# Altium schematic sheet Steering_Wheel_ECU.SchDoc
size A4
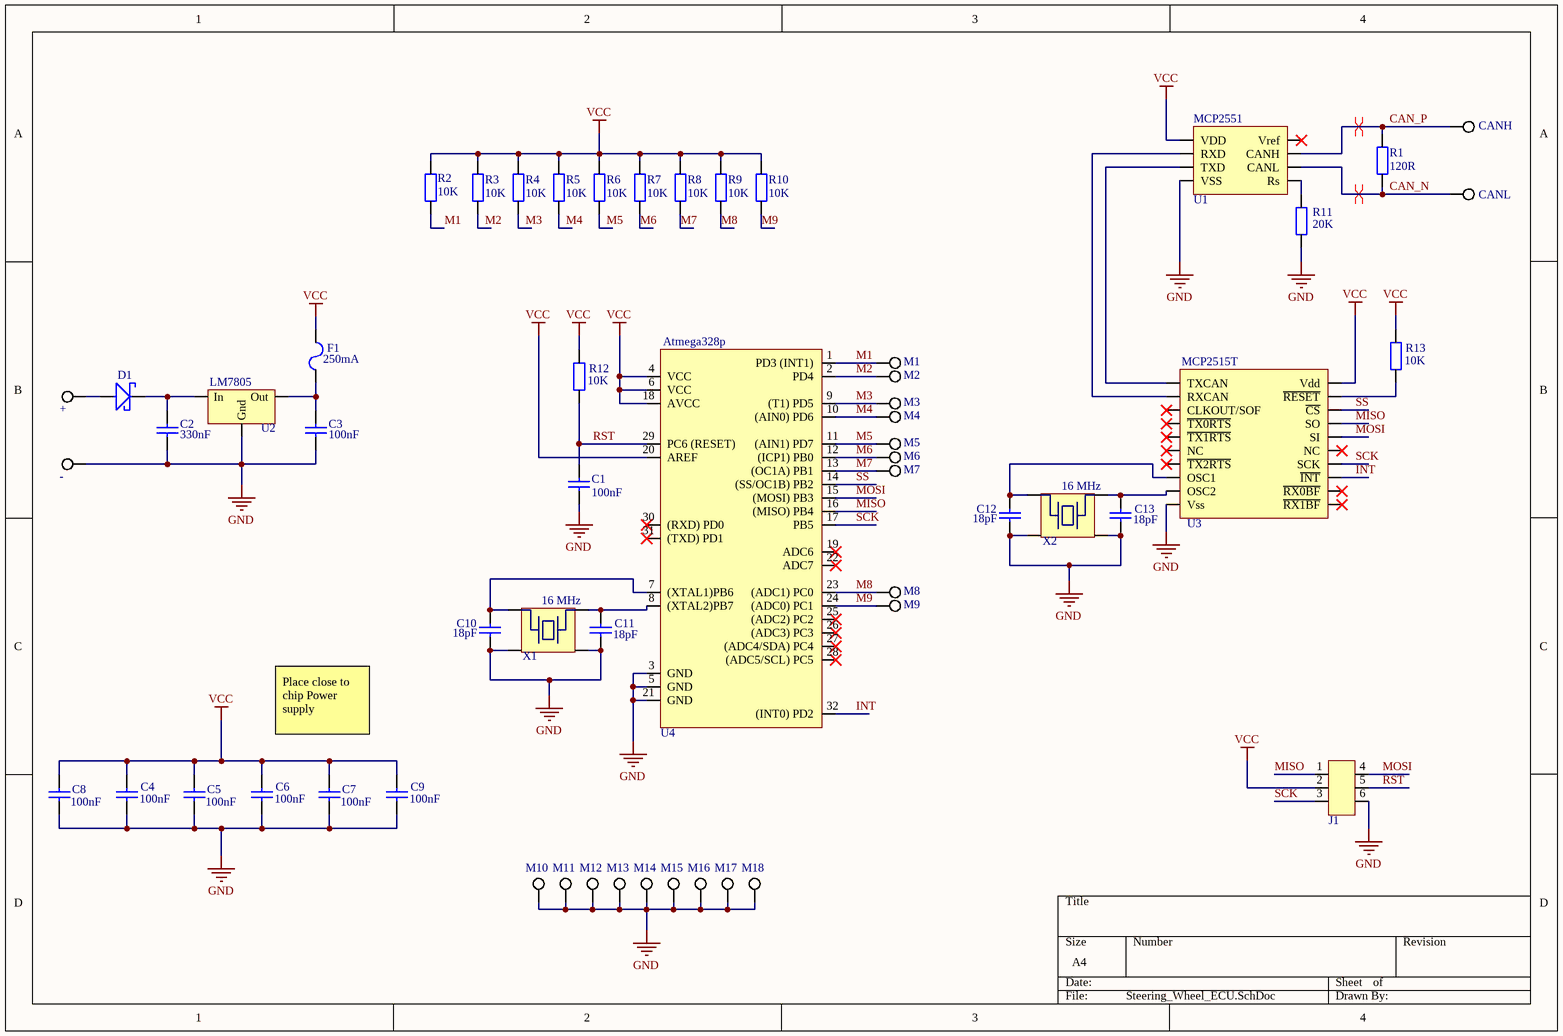
[diagram p0: Steering_Wheel_ECU.SchDoc]

## Parts
+  0.7mm  [HOLE_0.7MM]  (value not drawn)
-  0.7mm  [HOLE_0.7MM]  (value not drawn)
C1  100nF  [CAPC160X80X87L35N]
C2  330nF  [CAPC320X160X90L50N]
C3  100nF  [CAPC160X80X87L35N]
C4  100nF  [CAPC160X80X87L35N]
C5  100nF  [CAPC160X80X87L35N]
C6  100nF  [CAPC160X80X87L35N]
C7  100nF  [CAPC160X80X87L35N]
C8  100nF  [CAPC160X80X87L35N]
C9  100nF  [CAPC160X80X87L35N]
C10  18pF  [CAPC152X76X91L25N]
C11  18pF  [CAPC152X76X91L25N]
C12  18pF  [CAPC152X76X91L25N]
C13  18pF  [CAPC152X76X91L25N]
CANH  0.7mm  [HOLE_0.7MM]  (value not drawn)
CANL  0.7mm  [HOLE_0.7MM]  (value not drawn)
D1  MBR0540  [SOD375X160X128L31X60N]  (value not drawn)
F1  250mA  [FUSC325X165X75L42N]
J1  Header_2x3  [HDRV6W64P254_3X2_762X508H1100N]  (value not drawn)
M1  0.7mm  [HOLE_0.7MM]  (value not drawn)
M2  0.7mm  [HOLE_0.7MM]  (value not drawn)
M3  0.7mm  [HOLE_0.7MM]  (value not drawn)
M4  0.7mm  [HOLE_0.7MM]  (value not drawn)
M5  0.7mm  [HOLE_0.7MM]  (value not drawn)
M6  0.7mm  [HOLE_0.7MM]  (value not drawn)
M7  0.7mm  [HOLE_0.7MM]  (value not drawn)
M8  0.7mm  [HOLE_0.7MM]  (value not drawn)
M9  0.7mm  [HOLE_0.7MM]  (value not drawn)
M10  0.7mm  [HOLE_0.7MM]  (value not drawn)
M11  0.7mm  [HOLE_0.7MM]  (value not drawn)
M12  0.7mm  [HOLE_0.7MM]  (value not drawn)
M13  0.7mm  [HOLE_0.7MM]  (value not drawn)
M14  0.7mm  [HOLE_0.7MM]  (value not drawn)
M15  0.7mm  [HOLE_0.7MM]  (value not drawn)
M16  0.7mm  [HOLE_0.7MM]  (value not drawn)
M17  0.7mm  [HOLE_0.7MM]  (value not drawn)
M18  0.7mm  [HOLE_0.7MM]  (value not drawn)
R1  120R  [RESC160X80X50L30N]
R2  10K  [RESC160X80X50L30N]
R3  10K  [RESC160X80X50L30N]
R4  10K  [RESC160X80X50L30N]
R5  10K  [RESC160X80X50L30N]
R6  10K  [RESC160X80X50L30N]
R7  10K  [RESC160X80X50L30N]
R8  10K  [RESC160X80X50L30N]
R9  10K  [RESC160X80X50L30N]
R10  10K  [RESC160X80X50L30N]
R11  20K  [RESC160X80X50L30N]
R12  10K  [RESC160X80X50L30N]
R13  10K  [RESC160X80X50L30N]
U1  MCP2551  [SOIC8P127_490X600X175L83X24N]
U2  LM7805  [SOT223-4P230_700X180L80X75N]
U3  MCP2515T  [SOP20P65_650X640X120L60X24N]
U4  Atmega328p  [QFP32P80_900X900X120L60X37N]
X1  16 MHz  [OSCCC320X250X60L90X110N]
X2  16 MHz  [OSCCC320X250X60L90X110N]

## Nets
GND: -.1 C1.2 C2.1 C3.2 C4.2 C5.2 C6.2 C7.2 C8.2 C9.2 C10.2 C11.2 C12.2 C13.2 J1.6 M10.1 M11.1 M12.1 M13.1 M14.1 M15.1 M16.1 M17.1 M18.1 R11.1 U1.2(VSS) U2.2(Gnd) U3.10(Vss) U4.3(GND) U4.5(GND) U4.21(GND) X1.2 X1.4 X2.2 X2.4
VCC: C4.1 C5.1 C6.1 C7.1 C8.1 C9.1 F1.1 J1.2 R2.1 R3.2 R4.2 R5.2 R6.2 R7.2 R8.2 R9.2 R10.2 R12.2 R13.2 U1.3(VDD) U3.20(Vdd) U4.4(VCC) U4.6(VCC) U4.18(AVCC) U4.20(AREF)
CAN_N: CANL.1 R1.2 U1.6(CANL)
CAN_P: CANH.1 R1.1 U1.7(CANH)
INT: U3.13(~{INT}) U4.32((INT0)_PD2)
M1: M1.1 R2.2 U4.1(PD3_(INT1))
M2: M2.1 R3.1 U4.2(PD4)
M3: M3.1 R4.1 U4.9((T1)_PD5)
M4: M4.1 R5.1 U4.10((AIN0)_PD6)
M5: M5.1 R6.1 U4.11((AIN1)_PD7)
M6: M6.1 R7.1 U4.12((ICP1)_PB0)
M7: M7.1 R8.1 U4.13((OC1A)_PB1)
M8: M8.1 R9.1 U4.23((ADC1)_PC0)
M9: M9.1 R10.1 U4.24((ADC0)_PC1)
MISO: J1.1 U3.17(SO) U4.16((MISO)_PB4)
MOSI: J1.4 U3.16(SI) U4.15((MOSI)_PB3)
RST: C1.1 J1.5 R12.1 U4.29(PC6_(RESET))
SCK: J1.3 U3.14(SCK) U4.17(PB5)
SS: U3.18(~{CS}) U4.14((SS/OC1B)_PB2)
Net+_1: +.1 D1.A
NetC2_2: C2.2 D1.C U2.1(In)
NetC3_1: C3.1 F1.2 U2.3(Out)
NetC10_1: C10.1 U4.7((XTAL1)PB6) X1.3
NetC11_1: C11.1 U4.8((XTAL2)PB7) X1.1
NetC12_1: C12.1 U3.9(OSC1) X2.3
NetC13_1: C13.1 U3.8(OSC2) X2.1
NetR11_2: R11.2 U1.8(Rs)
NetR13_1: R13.1 U3.19(~{RESET})
NetU1_1: U1.1(TXD) U3.1(TXCAN)
NetU1_4: U1.4(RXD) U3.2(RXCAN)

Not connected (* = marked no-connect by the designer): U1 5(Vref)*; U3 3(CLKOUT/SOF)* 4(~{TX0RTS})* 5(~{TX1RTS})* 6(NC)* 7(~{TX2RTS})* 11(~{RX1BF})* 12(~{RX0BF})* 15(NC)*; U4 19(ADC6)* 22(ADC7)* 25((ADC2)_PC2)* 26((ADC3)_PC3)* 27((ADC4/SDA)_PC4)* 28((ADC5/SCL)_PC5)* 30((RXD)_PD0)* 31((TXD)_PD1)*

## Layout directives
differential pair: CAN_N, CAN_P

## Notes on the sheet
- Place close to chip Power supply

## Library data of the parts
+ - CANH CANL M1-M18 = Hole_0.7mm: FR_SN: M-05; Part Number: Hole_0.7mm; Value: 0.7mm; Manufacturer Part Number: N/A; ComponentLinkDescription: N/A; Supplier Part Number: N/A
C1 C3-C9 = C_0603_100nF_50V: Manufacturer Part Number: CC0603MRY5V9BB104; Voltage Rating: 50V; Capacitor Case Style: 0603; ComponentLinkDescription: Datasheet; FR_SN: C_NP-02; Part Number: C_0603_100nF_50V; Value: 100nF; ComponentLinkURL: https://hr.mouser.com/datasheet/2/212/KEM_C1027_X7; Supplier Part Number: 603-C0603MRY5V9BB104
C2 = C_1206_330nF_50V: Manufacturer Part Number: 1206B334K500CT; Voltage Rating: 50V; Capacitor Case Style: 1206; ComponentLinkDescription: Datasheet; FR_SN: C_NP-03; Part Number: C_1206_330nF_50V; Value: 330nF; ComponentLinkURL: https://hr.mouser.com/datasheet/2/210/WTC_MLCC_Gen; Supplier Part Number: 791-1206B334K500CT
C10-C13 = C_0603_18pF_50V: Manufacturer Part Number: 06035U180GAT2A; Voltage Rating: 50V; Capacitor Case Style: 0603; ComponentLinkDescription: Datasheet; FR_SN: C_NP-21; Part Number: C_0603_18pF_50V; Value: 18pF; ComponentLinkURL: https://hr.mouser.com/datasheet/2/40/U-Series-8942; Supplier Part Number: 581-06035U180GAT2A
D1 = MBR0540: Max Reverse Voltage: 40 V; Diode Case Style: SOD-123; Forward Current: 500 mA; ComponentLinkDescription: Datasheet; FR_SN: D_S-01; Part Number: MBR0540; Value: MBR0540; Manufacturer Part Number: MBR0540; ComponentLinkURL: https://hr.mouser.com/datasheet/2/308/MBR0540-1306677.pdf; Supplier Part Number: 512-MBR0540
F1 = F_250mA: Manufacturer Part Number: 0ZCJ0025FF2E; Holding Current: 500mA; Fuse Case Style: 1206; ComponentLinkDescription: Datasheet; FR_SN: F-01; Part Number: F_250mA; Value: 250mA; Tripping Current: 250mA; ComponentLinkURL: https://hr.mouser.com/datasheet/2/643/0ZCJ_Nov2016-1132002.pdf; Supplier Part Number: 530-0ZCJ0025FF2E
J1 = Header_2x3: Manufacturer Part Number: M20-9970345; ComponentLinkDescription: Datasheet; FR_SN: J-02; Part Number: Header_2x3; Value: Header_2x3; ComponentLinkURL: https://hr.mouser.com/datasheet/2/181/M20-997-1133533.pdf; Supplier Part Number: 855-M20-9970345
R1 = R_0805_120R_0W5: Manufacturer Part Number: SG73G2ATTD1200D; Power Rating: 500mW; Resistor Case Style: 0805; Temperature Coefficient: 50 PPM / C; FR_SN: R-20; Part Number: R_0805_120R_0W5; Value: 120R; ComponentLink1URL: https://hr.mouser.com/datasheet/2/219/SG73G-1316861.pdf; ComponentLink1Description: Datasheet; Supplier Part Number: 660-SG73G2ATTD1200D
R2-R10 R12 R13 = R_0603_10K_0W062_P: Manufacturer Part Number: APC0603B10K0N; Power Rating: 62.5mW; Resistor Case Style: 0603; Temperature Coefficient: 25 PPM / C; FR_SN: R-11; Part Number: R_0603_10K_0W062_P; Value: 10K; ComponentLink1URL: https://hr.mouser.com/datasheet/2/303/APC-1-15.34-911303.pdf; ComponentLink1Description: Datasheet; Supplier Part Number: 284-APC0603B10K0N
R11 = R_0603_20K_0W1: Manufacturer Part Number: RT0603DRE0720KL; Power Rating: 100mW; Resistor Case Style: 0603; Temperature Coefficient: 50 PPM / C; FR_SN: R-04; Part Number: R_0603_20K_0W1; Value: 20K; ComponentLink1URL: https://hr.mouser.com/datasheet/2/447/PYu-RT_1-to-0.01_RoHS_L_9-1222720.pdf; ComponentLink1Description: Datasheet; Supplier Part Number: 603-RT0603DRE0720KL
U1 = MCP2551: Manufacturer Part Number: MCP2551-I/SN; IC Case Style: SOIC-8; ComponentLinkDescription: Datasheet; FR_SN: IC_Misc-04; Part Number: MCP2551; Value: MCP2551; Category: Hi Spd CAN Transceiver; ComponentLinkURL: https://hr.mouser.com/datasheet/2/268/20001667G-1115479.pdf; Supplier Part Number: 579-MCP2551-I/SN
U2 = U_5V: Part Number: U_5V; Manufacturer Part Number: UA78M05CDCYR; Max Input Voltage: 35V; Output Current: 1.5A; Output Voltage: 5V; IC Case Style: SOT223; ComponentLinkDescription: Datasheet; FR_SN: U_REG-01; Value: LM7805; Category: Fixed Positive Voltage Regulator; ComponentLinkURL: http://www.ti.com/lit/ds/symlink/lm340.pdf; Supplier Part Number: 595-UA78M05CDCYR
U3 = MCP2515: Manufacturer Part Number: MCP2515T-I/ST; IC Case Style: TSSOP-20; ComponentLinkDescription: Datasheet; FR_SN: IC_Misc-03; Part Number: MCP2515; Value: MCP2515T; Category: CAN Controller with SPI Interface; ComponentLinkURL: https://hr.mouser.com/datasheet/2/268/20001801H-708845.pdf; Supplier Part Number: 579-MCP2515T-I/ST
U4 = Atmega328p: Manufacturer Part Number: ATMEGA328P-AUR; IC Case Style: TQFP-32; ComponentLinkDescription: Datasheet; FR_SN: MCU-01; Part Number: Atmega328p; Value: Atmega328p; Category: Arduino Nano MCU; ComponentLinkURL: https://hr.mouser.com/datasheet/2/268/40001906A-1222909.pdf; Supplier Part Number: 556-ATMEGA328P-AUR
X1 X2 = X_16MHZ_9pF: Manufacturer Part Number: TSX-3225 16.0000MF09Z-AC3; Frequency Tolerance: 10 PPM; Frequency: 16MHz; ComponentLinkDescription: Datasheet; FR_SN: X-09; Part Number: X_16MHZ_9pF; Value: 16 MHz; ComponentLinkURL: https://hr.mouser.com/datasheet/2/137/A-238_en-932914.pdf; Supplier Part Number: 732-TX325-16F09Z-AC3